# EAGLE design G4_TechWatch-BASIC (EAGLE 9.6.2)
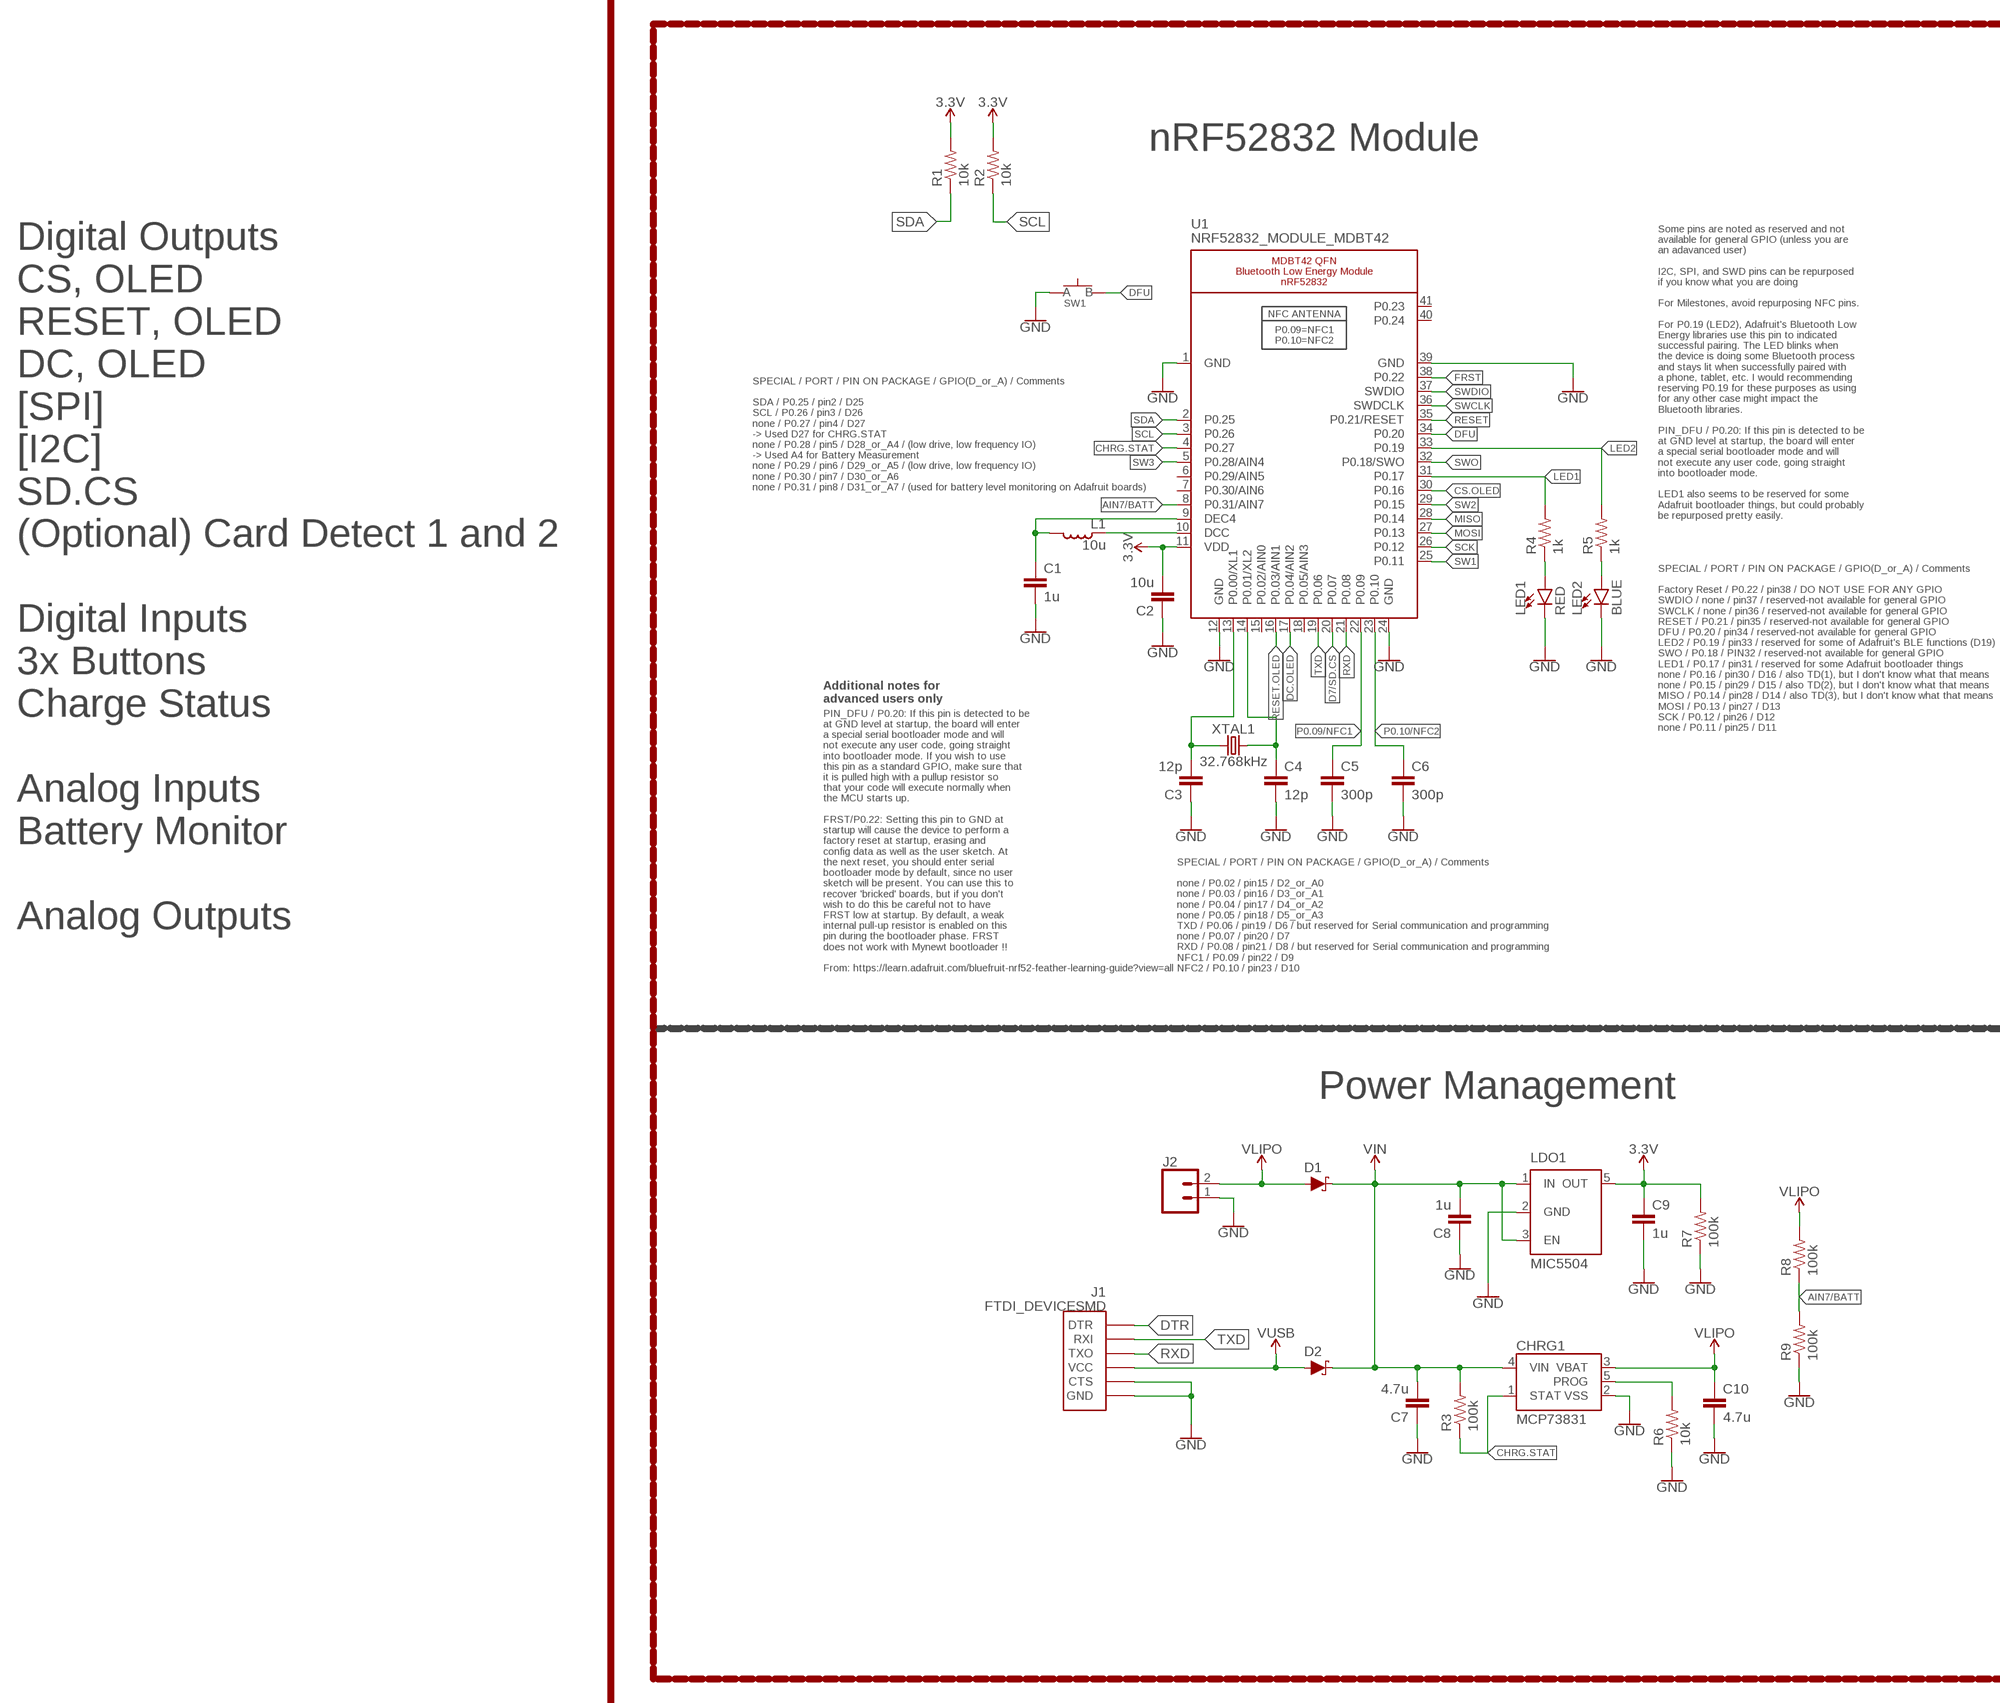
[diagram p0: schematic, sheet 1, part 1 of 2]
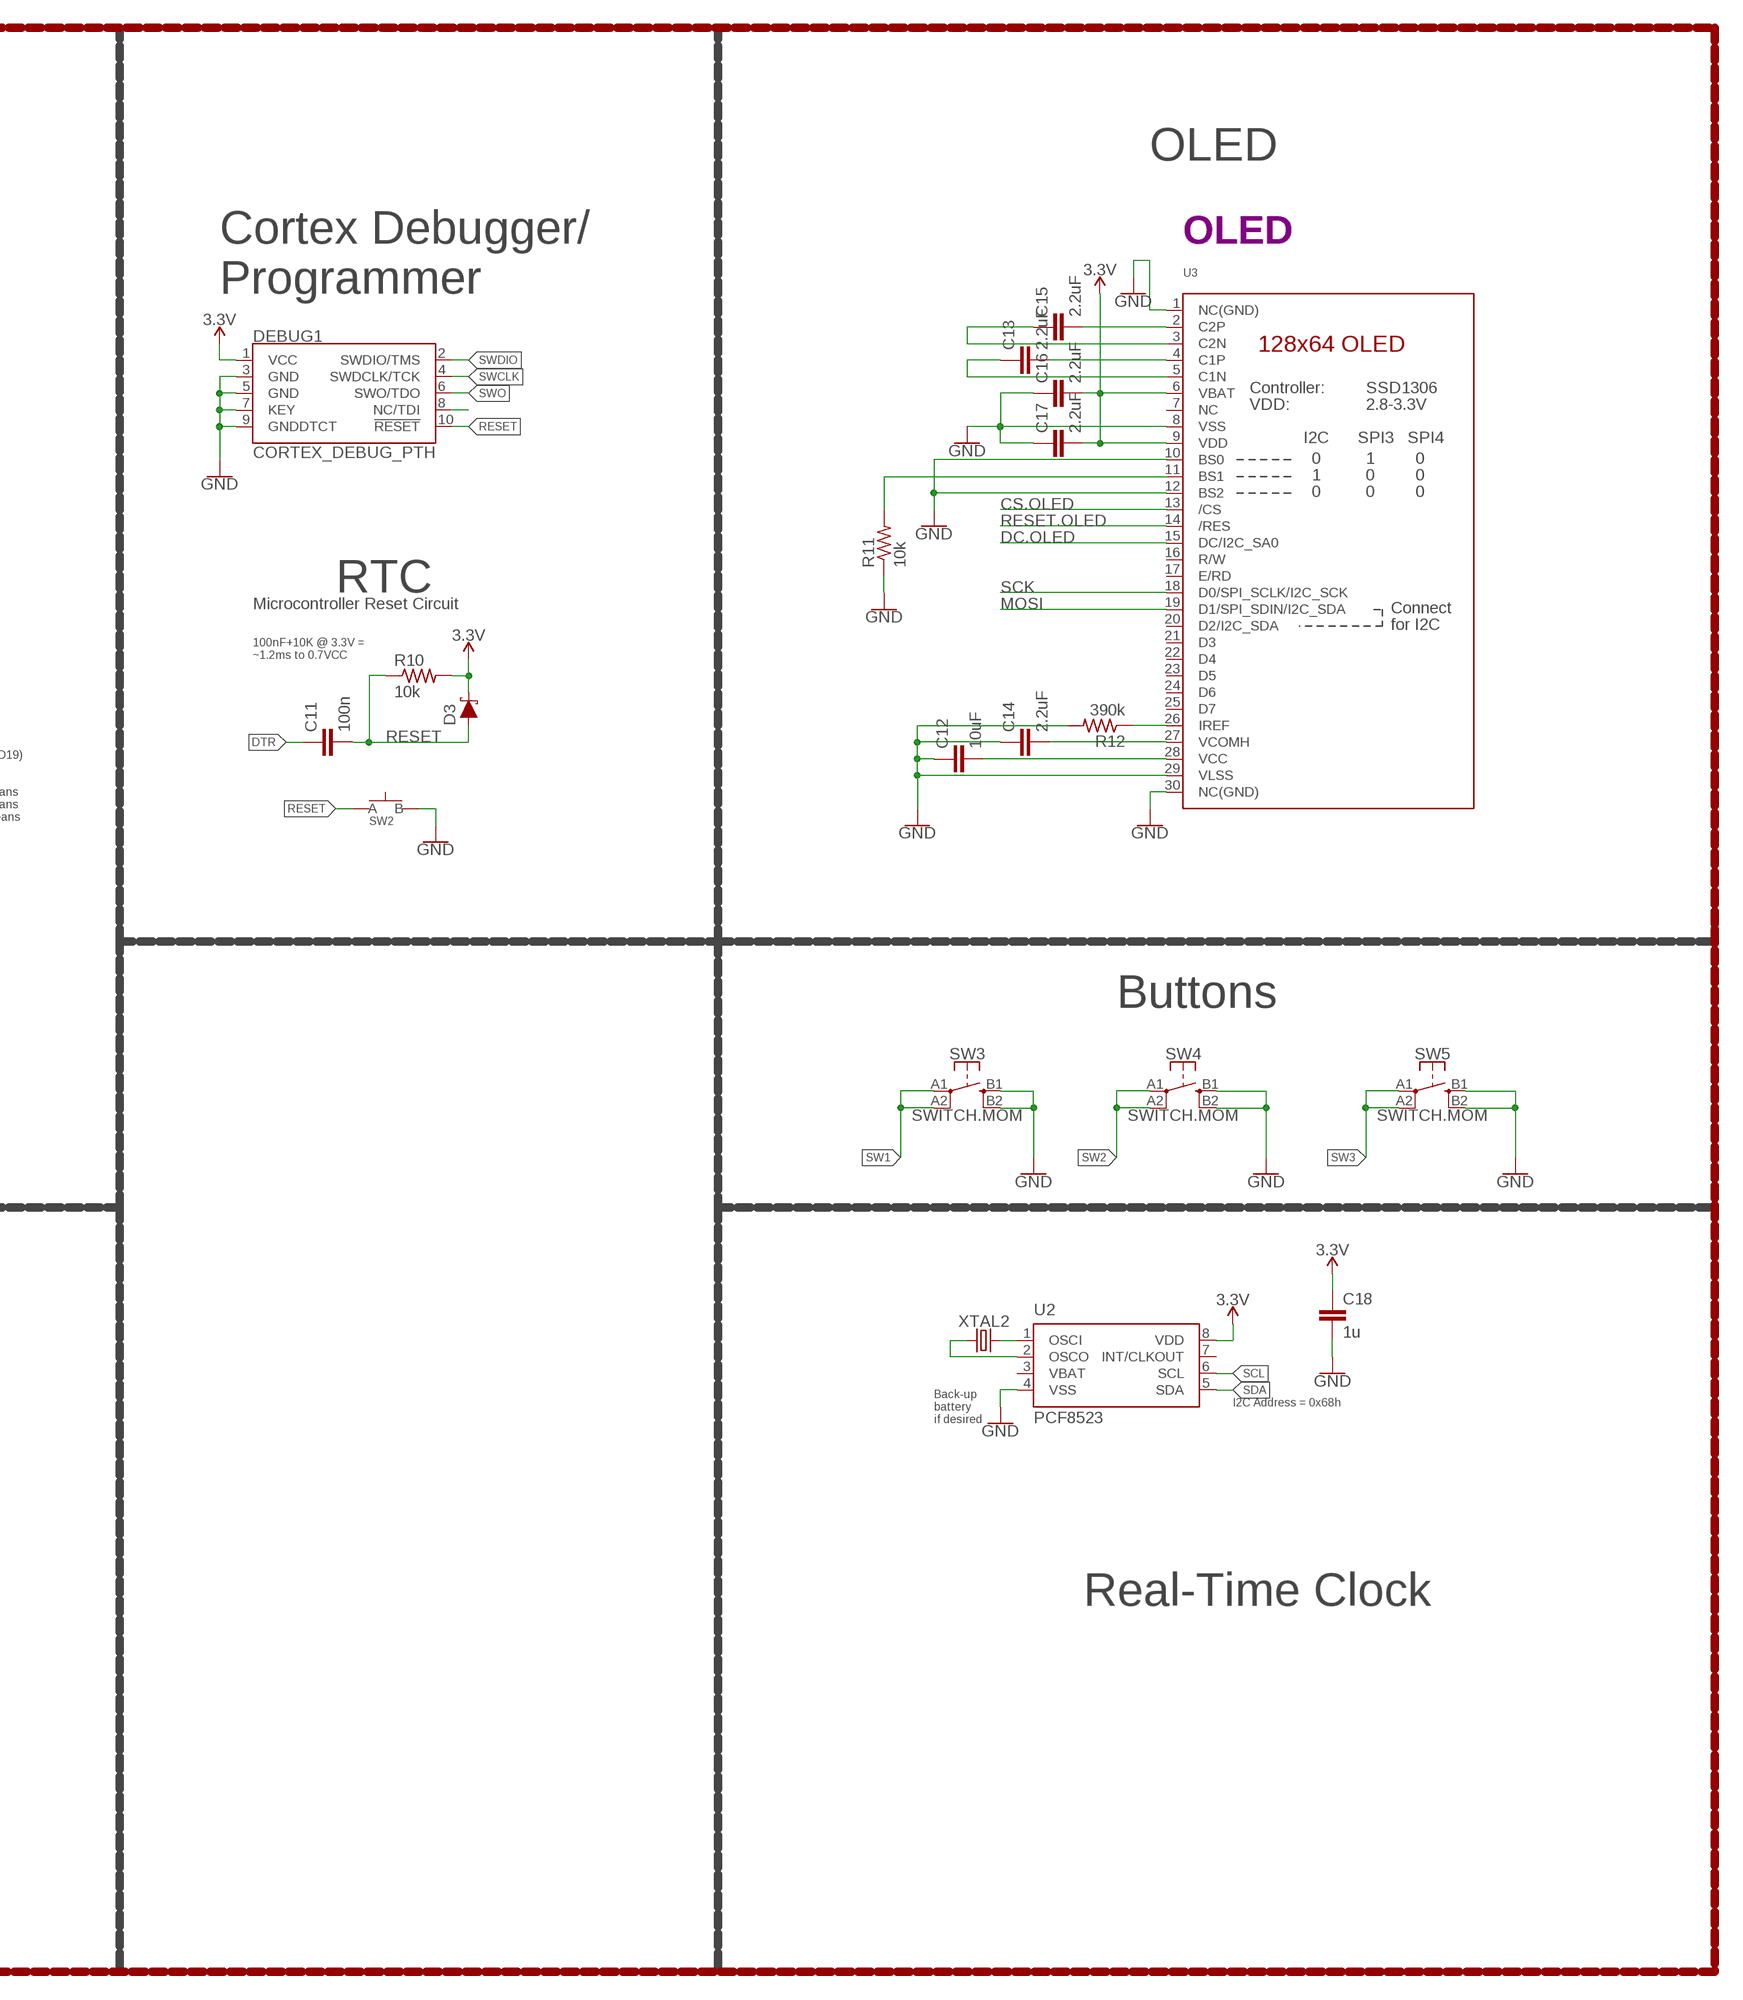
[diagram p1: schematic, sheet 1, part 2 of 2]

## Parts
C1  1u  CAPACITOR0603  [C0603]
C2  10u  CAPACITOR0805  [C0805]
C3  12p  CAPACITOR0603  [C0603]
C4  12p  CAPACITOR0603  [C0603]
C5  300p  CAPACITOR0603  [C0603]
C6  300p  CAPACITOR0603  [C0603]
C7  4.7u  CAPACITOR0603  [C0603]
C8  1u  CAPACITOR0603  [C0603]
C9  1u  CAPACITOR0603  [C0603]
C10  4.7u  CAPACITOR0603  [C0603]
C11  100n  CAPACITOR0603  [C0603]
C12  10uF  CAPACITOR0603  [C0603]
C13  2.2uF  CAPACITOR0402  [C0402]
C14  2.2uF  CAPACITOR0402  [C0402]
C15  2.2uF  CAPACITOR0402  [C0402]
C16  2.2uF  CAPACITOR0402  [C0402]
C17  2.2uF  CAPACITOR0402  [C0402]
C18  1u  CAPACITOR0603  [C0603]
CHRG1  MCP73831  [SOT23-5]
D1  SCHOTTKY-USC  [USC]
D2  SCHOTTKY-USC  [USC]
D3  SCHOTTKY-USC  [USC]
DEBUG1  CORTEX_DEBUG_PTH  [2X5-PTH-1.27MM]
J1  FTDI_DEVICESMD  [FTDI-SMD]
J2  CONN_02  [1X02]
L1  10u  INDUCTOR0603  [L0603]
LDO1  MIC5504  [SOT23-5]
LED1  RED  LED0603  [LED-0603]
LED2  BLUE  LED0603  [LED-0603]
R1  10k  RESISTOR0603  [R0603]
R2  10k  RESISTOR0603  [R0603]
R3  100k  RESISTOR0603  [R0603]
R4  1k  RESISTOR0603  [R0603]
R5  1k  RESISTOR0603  [R0603]
R6  10k  RESISTOR0603  [R0603]
R7  100k  RESISTOR0603  [R0603]
R8  100k  RESISTOR0603  [R0603]
R9  100k  RESISTOR0603  [R0603]
R10  10k  RESISTOR0603  [R0603]
R11  10k  RESISTOR0603  [R0603]
R12  390k  RESISTOR0603  [R0603]
SW1  SPST-PTS830GG140-COPY.1-3  [BUTTON-GULLWING]
SW2  SPST-PTS830GG140-COPY.1-3  [BUTTON-GULLWING]
SW3  SWITCH.MOM  [TACTILE_SWITCH_SMD_6.2MM_TALL]
SW4  SWITCH.MOM  [TACTILE_SWITCH_SMD_6.2MM_TALL]
SW5  SWITCH.MOM  [TACTILE_SWITCH_SMD_6.2MM_TALL]
U1  NRF52832_MODULE_MDBT42  [BLE_MODULE_RAYTAC_MDBT42]
U2  PCF8523  [SO8]
U3  DISP_OLED_UG-2864HSWEG01-NO-WRAPAROUND  [UG-2864HSWEG01_0.96IN_NO-WRAPAROUND]
XTAL1  32.768kHz  CRYSTALECS-.327-12.5-12-C-TR  [2-SMD.NOLEAD.2.0MMTO1.2MM]
XTAL2  32.7680kHz  CRYSTALECS-.327-12.5-12-C-TR  [2-SMD.NOLEAD.2.0MMTO1.2MM]

## Nets
3.3V: C2.2 C9.1 C16.2 C17.2 C18.1 D3.-(C) DEBUG1.1(VCC) LDO1.5(OUT) R1.2 R2.2 R7.2 R10.2 U1.11(VDD) U2.8(VDD) U3.6(VBAT) U3.9(VDD)
AIN7/BATT: R8.1 R9.2 U1.8(P0.31/AIN7)
CHRG.STAT: CHRG1.1(STAT) R3.1 U1.4(P0.27)
CS.OLED: U1.30(P0.16) U3.13(/CS)
D7/SD.CS: U1.20(P0.07)
DC.OLED: U1.17(P0.04/AIN2) U3.15(DC/I2C_SA0)
DFU: SW1.3(B) U1.34(P0.20)
DTR: C11.1 J1.DTR
FRST: U1.38(P0.22)
GND: C1.2 C2.1 C3.1 C4.2 C5.2 C6.2 C7.1 C8.1 C9.2 C10.2 C12.1 C14.1 C16.1 C17.1 C18.2 CHRG1.2(VSS) DEBUG1.3(GND) DEBUG1.5(GND) DEBUG1.7(KEY) DEBUG1.9(GNDDTCT) J1.CTS J1.GND J2.1 LDO1.2(GND) LED1.C LED2.C R6.1 R7.1 R9.1 R11.1 R12.2 SW1.1(A) SW2.3(B) SW3.B1 SW3.B2 SW4.B1 SW4.B2 SW5.B1 SW5.B2 U1.1(GND) U1.12(GND) U1.24(GND) U1.39(GND) U2.4(VSS) U3.1(NC(GND)) U3.8(VSS) U3.10(BS0) U3.12(BS2) U3.29(VLSS) U3.30(NC(GND))
LED1: R4.2 U1.31(P0.17)
LED2: R5.2 U1.33(P0.19)
MISO: U1.28(P0.14)
MOSI: U1.27(P0.13) U3.19(D1/SPI_SDIN/I2C_SDA)
N$1: R11.2 U3.11(BS1)
N$2: R12.1 U3.26(IREF)
N$3: C15.2 U3.2(C2P)
N$4: C3.2 U1.13(P0.00/XL1) XTAL1.P$1
N$5: C15.1 U3.3(C2N)
N$6: C4.1 U1.14(P0.01/XL2) XTAL1.P$2
N$7: C13.2 U3.4(C1P)
N$8: C13.1 U3.5(C1N)
N$9: LED1.A R4.1
N$10: LED2.A R5.1
N$11: L1.1 U1.10(DCC)
N$12: C1.1 L1.2 U1.9(DEC4)
N$13: C12.2 U3.28(VCC)
N$14: DEBUG1.8(NC/TDI)
N$15: C14.2 U3.27(VCOMH)
N$17: CHRG1.5(PROG) R6.2
N$19: U2.2(OSCO) XTAL2.P$1
N$20: U2.1(OSCI) XTAL2.P$2
P0.09/NFC1: C5.1 U1.22(P0.09)
P0.10/NFC2: C6.1 U1.23(P0.10)
RESET: C11.2 D3.+(A) DEBUG1.10(!RESET) R10.1 SW2.1(A) U1.35(P0.21/RESET)
RESET.OLED: U1.16(P0.03/AIN1) U3.14(/RES)
RXD: J1.TXO U1.21(P0.08)
SCK: U1.26(P0.12) U3.18(D0/SPI_SCLK/I2C_SCK)
SCL: R2.1 U1.3(P0.26) U2.6(SCL)
SDA: R1.1 U1.2(P0.25) U2.5(SDA)
SW1: SW3.A1 SW3.A2 U1.25(P0.11)
SW2: SW4.A1 SW4.A2 U1.29(P0.15)
SW3: SW5.A1 SW5.A2 U1.5(P0.28/AIN4)
SWCLK: DEBUG1.4(SWDCLK/TCK) U1.36(SWDCLK)
SWDIO: DEBUG1.2(SWDIO/TMS) U1.37(SWDIO)
SWO: DEBUG1.6(SWO/TDO) U1.32(P0.18/SWO)
TXD: J1.RXI U1.19(P0.06)
V_USB: D2.+(A) J1.VCC ; supply symbol labelled VUSB
VIN: C7.2 C8.2 CHRG1.4(VIN) D1.-(C) D2.-(C) LDO1.1(IN) LDO1.3(EN) R3.2
VLIPO: C10.1 CHRG1.3(VBAT) D1.+(A) J2.2 R8.2
Unconnected: U1.6(P0.29/AIN5) U1.7(P0.30/AIN6) U1.15(P0.02/AIN0) U1.18(P0.05/AIN3) U1.40(P0.24) U1.41(P0.23) U2.7(INT/CLKOUT) U3.7(NC) U3.16(R/W) U3.17(E/RD) U3.20(D2/I2C_SDA) U3.21(D3) U3.22(D4) U3.23(D5) U3.24(D6) U3.25(D7)

## Notes on the sheet
- OLED
- nRF52832 Module
- OLED
- Cortex Debugger/
  Programmer
- SPECIAL / PORT / PIN ON PACKAGE / GPIO(D_or_A) / Comments
  
  SDA / P0.25 / pin2 / D25
  SCL / P0.26 / pin3 / D26
  none / P0.27 / pin4 / D27 
  -> Used D27 for CHRG.STAT
  none / P0.28 / pin5 / D28_or_A4 / (low drive, low frequency IO) 
  -> Used A4 for Battery Measurement
  none / P0.29 / pin6 / D29_or_A5 / (low drive, low frequency IO)
  none / P0.30 / pin7 / D30_or_A6
  none / P0.31 / pin8 / D31_or_A7 / (used for battery level monitoring on Adafruit boards)
- RTC
- Some pins are noted as reserved and not
  available for general GPIO (unless you are
  an adavanced user)
  
  I2C, SPI, and SWD pins can be repurposed
  if you know what you are doing
  
  For Milestones, avoid repurposing NFC pins.
  
  For P0.19 (LED2), Adafruit's Bluetooth Low
  Energy libraries use this pin to indicated
  successful pairing. The LED blinks when
  the device is doing some Bluetooth process
  and stays lit when successfully paired with
  a phone, tablet, etc. I would recommending
  reserving P0.19 for these purposes as using
  for any other case might impact the
  Bluetooth libraries.
  
  PIN_DFU / P0.20: If this pin is detected to be
  at GND level at startup, the board will enter
  a special serial bootloader mode and will
  not execute any user code, going straight
  into bootloader mode.
  
  LED1 also seems to be reserved for some
  Adafruit bootloader things, but could probably
  be repurposed pretty easily.
- Microcontroller Reset Circuit
- 100nF+10K @ 3.3V =
  ~1.2ms to 0.7VCC
- Additional notes for
  advanced users only
- SPECIAL / PORT / PIN ON PACKAGE / GPIO(D_or_A) / Comments
  
  Factory Reset / P0.22 / pin38 / DO NOT USE FOR ANY GPIO
  SWDIO / none / pin37 / reserved-not available for general GPIO
  SWCLK / none / pin36 / reserved-not available for general GPIO
  RESET / P0.21 / pin35 / reserved-not available for general GPIO
  DFU / P0.20 / pin34 / reserved-not available for general GPIO
  LED2 / P0.19 / pin33 / reserved for some of Adafruit's BLE functions (D19)
  SWO / P0.18 / PIN32 / reserved-not available for general GPIO
  LED1 / P0.17 / pin31 / reserved for some Adafruit bootloader things
  none / P0.16 / pin30 / D16 / also TD(1), but I don't know what that means
  none / P0.15 / pin29 / D15 / also TD(2), but I don't know what that means
  MISO / P0.14 / pin28 / D14 / also TD(3), but I don't know what that means
  MOSI / P0.13 / pin27 / D13
  SCK / P0.12 / pin26 / D12
  none / P0.11 / pin25 / D11
- Buttons
- Digital Outputs
  CS, OLED
  RESET, OLED
  DC, OLED
  [SPI]
  [I2C]
  SD.CS
  (Optional) Card Detect 1 and 2
  
  Digital Inputs
  3x Buttons
  Charge Status
  
  Analog Inputs
  Battery Monitor
  
  Analog Outputs
- PIN_DFU / P0.20: If this pin is detected to be
  at GND level at startup, the board will enter
  a special serial bootloader mode and will
  not execute any user code, going straight
  into bootloader mode. If you wish to use
  this pin as a standard GPIO, make sure that
  it is pulled high with a pullup resistor so
  that your code will execute normally when
  the MCU starts up.
  
  FRST/P0.22: Setting this pin to GND at
  startup will cause the device to perform a
  factory reset at startup, erasing and
  config data as well as the user sketch. At
  the next reset, you should enter serial
  bootloader mode by default, since no user
  sketch will be present. You can use this to
  recover 'bricked' boards, but if you don't
  wish to do this be careful not to have
  FRST low at startup. By default, a weak
  internal pull-up resistor is enabled on this
  pin during the bootloader phase. FRST
  does not work with Mynewt bootloader !!
  
  From: https://learn.adafruit.com/bluefruit-nrf52-feather-learning-guide?view=all
- SPECIAL / PORT / PIN ON PACKAGE / GPIO(D_or_A) / Comments
  
  none / P0.02 / pin15 / D2_or_A0
  none / P0.03 / pin16 / D3_or_A1
  none / P0.04 / pin17 / D4_or_A2
  none / P0.05 / pin18 / D5_or_A3
  TXD / P0.06 / pin19 / D6 / but reserved for Serial communication and programming
  none / P0.07 / pin20 / D7
  RXD / P0.08 / pin21 / D8 / but reserved for Serial communication and programming
  NFC1 / P0.09 / pin22 / D9
  NFC2 / P0.10 / pin23 / D10
- Power Management
- I2C Address = 0x68h
- Back-up
  battery
  if desired
- Real-Time Clock

## Power pins joined to a net without a drawn wire
VBAT: U2.3(VBAT)

## Library data of the parts
C1-C18 = LinnesLab-Passives:CAPACITOR
CHRG1 = LinnesLab-Power:MCP73831: MCP73831T Li-Ion, Li-Pol Controller Miniature single cell, fully integrated Li-Ion, Li-polymer charge management controller Datasheet <http://ww1.microchip.com/downloads/en/DeviceDoc/20001984g.pdf> SparkFun Products: SparkFun ESP32 Thing <https://www.sparkfun.com/products/13907> SparkFun 9DoF Razor IMU M0 <https://www.sparkfun.com/products/14001>; PROD_ID: IC-09995
D1-D3 = LinnesLab-DiscreteSemi:SCHOTTKY: Schottky diode A Schottky diode is a semiconductor diode which has a low forward voltage drop and a very fast switching action. Example: Digi-Key Part Number: RB161MM-20CT-ND
DEBUG1 = LinnesLab-Connectors:CORTEX_DEBUG: Cortex Debug Connector - 10 pin Supports JTAG debug, Serial Wire debug, and Serial Wire Viewer. PTH and SMD connector options available. General Connector Information <http://infocenter.arm.com/help/topic/com.arm.doc.faqs/attached/13634/cortex_debug_connectors.pdf> Products: PTH Connector <http://www.digikey.com/product-detail/en/cnc-tech/3220-10-0100-00/1175-1627-ND/3883661> -via Digi-Key SparkFun PSoc <https://www.sparkfun.com/products/13229> SparkFun T <https://www.sparkfun.com/products/13810>
J1 = LinnesLab-Connectors:FTDI_DEVICE
J2 = LinnesLab-Connectors:CONN_02: Multi connection point. Often used as Generic Header-pin footprint for 0.1 inch spaced/style header connections On any of the 0.1 inch spaced packages, you can populate with these: Break Away Headers - Straight <https://www.sparkfun.com/products/116> (PRT-00116) Break Away Male Headers - Right Angle <https://www.sparkfun.com/products/553> (PRT-00553) Female Headers <https://www.sparkfun.com/products/115> (PRT-00115) Break Away Headers - Machine Pin <https://www.sparkfun.com/products/117> (PRT-00117) Break Away Female Headers - Swiss Machine Pin <https://www.sparkfun.com/products/743> (PRT-00743) For SCREWTERMINALS and SPRING TERMINALS visit here: Screw Terimnals on SparkFun.com <https://www.sparkfun.com/search/results?term=Screw+Terminals> (5mm/3.5mm/2.54mm spacing) This device is also useful as a general connection point to wire up your design to another part of your project. Our various solder wires solder well into these plated through hole pads. Hook-Up Wire - Assortment (Stranded, 22 AWG) <https://www.sparkfun.com/products/11375> (PRT-11375) Hook-Up Wire - Assortment (Solid Core, 22 AWG) <https://www.sparkfun.com/products/11367> (PRT-11367) View the entire wire category on our website here <https://www.sparkfun.com/categories/141> Special notes: Molex polarized connector foot print use with: PRT-08233 with associated crimp pins and housings. 2.54_SCREWTERM for use with PRT-10571. 3.5mm Screw Terminal footprints for PRT-08084 5mm Screw Terminal footprints for use with PRT-08432
L1 = LinnesLab-Passives:INDUCTOR
LDO1 = LinnesLab-Power:MIC5504: MIC5504 Voltage Regulator Output Voltages: 1.0V to 3.3V Input Voltages: 2.5V to 5.5V Link to Datasheet http://ww1.microchip.com/downloads/en/DeviceDoc/MIC550X.pdf
LED1 LED2 = LinnesLab-LED:LED: LED (Generic) Standard schematic elements and footprints for 5mm, 3mm, 1206, and 0603 sized LEDs. Generic LEDs with no color specified. LTST-C190KGKT: arrow indicates cathode
R1-R12 = LinnesLab-Passives:RESISTOR
SW1 SW2 = LinnesLab-Switches:SPST-PTS830GG140-COPY
SW3-SW5 = LinnesLab-Switches:SWITCH.MOM: PTS645SM43SMTR92 LFS
U1 = LinnesLab-Microcontrollers:NRF52832_MODULE_MDBT42: MDBT42 - BLE Module (nRF52832 QFN) VDD: 1.7-3.6V
U2 = LinnesLab-Clocks:PCF8523; DIGIKEY: 568-5306-1-ND; I2C_ADDRESS: 0x68h; MFN: PCF8523T/1,118; MFN_MANUFACTURER: NXP USA Inc.
U3 = LinnesLab-Displays:DISP_OLED_UG-2864HSWEG01: UG-2864HSWEG01 OLED display Both 1.3" and 0.96" models share the same FPC tab footprint, only the screen dimensions vary.
XTAL1 XTAL2 = LinnesLab-Clocks:CRYSTAL; DIGIKEY: XC2288CT-ND; FREQ: 32.7680KHZ; LOAD_CAP: 12.5pF

## Board
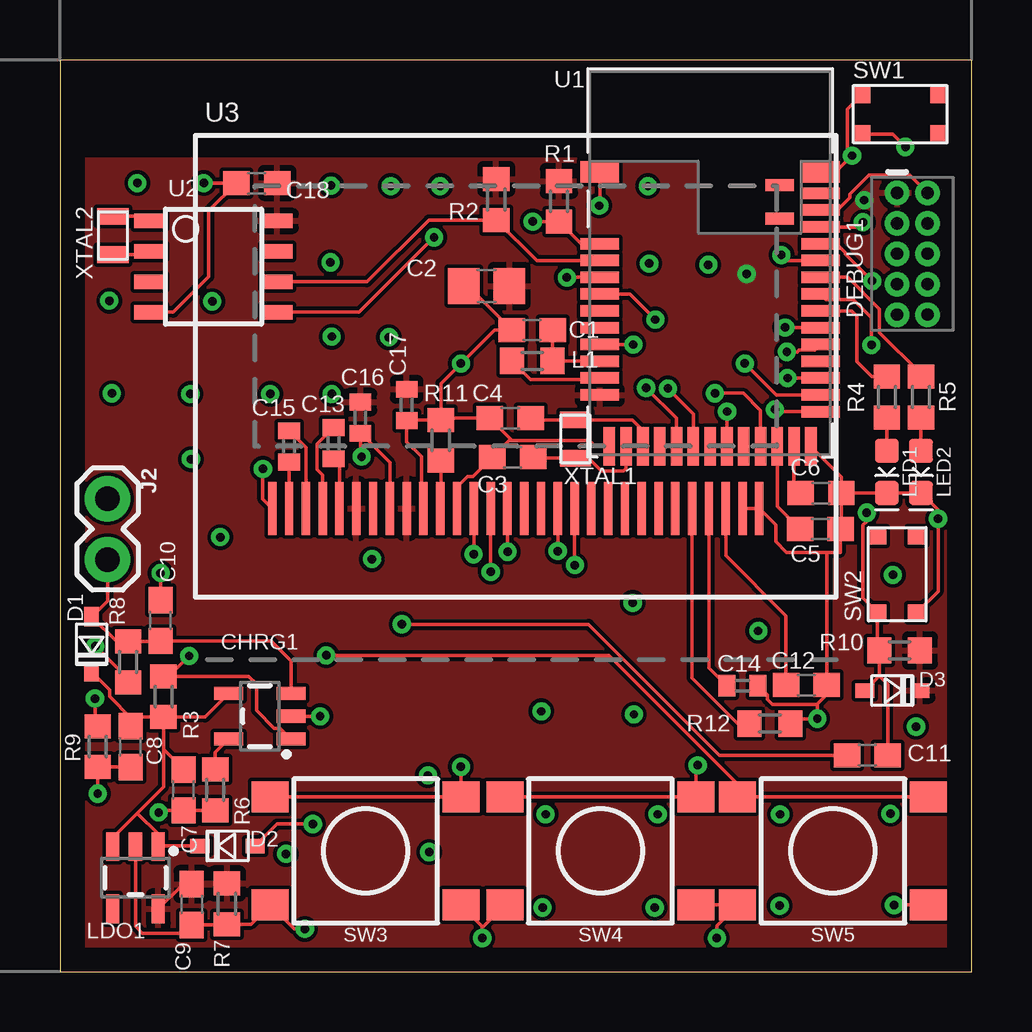
[diagram p2: board, top side]
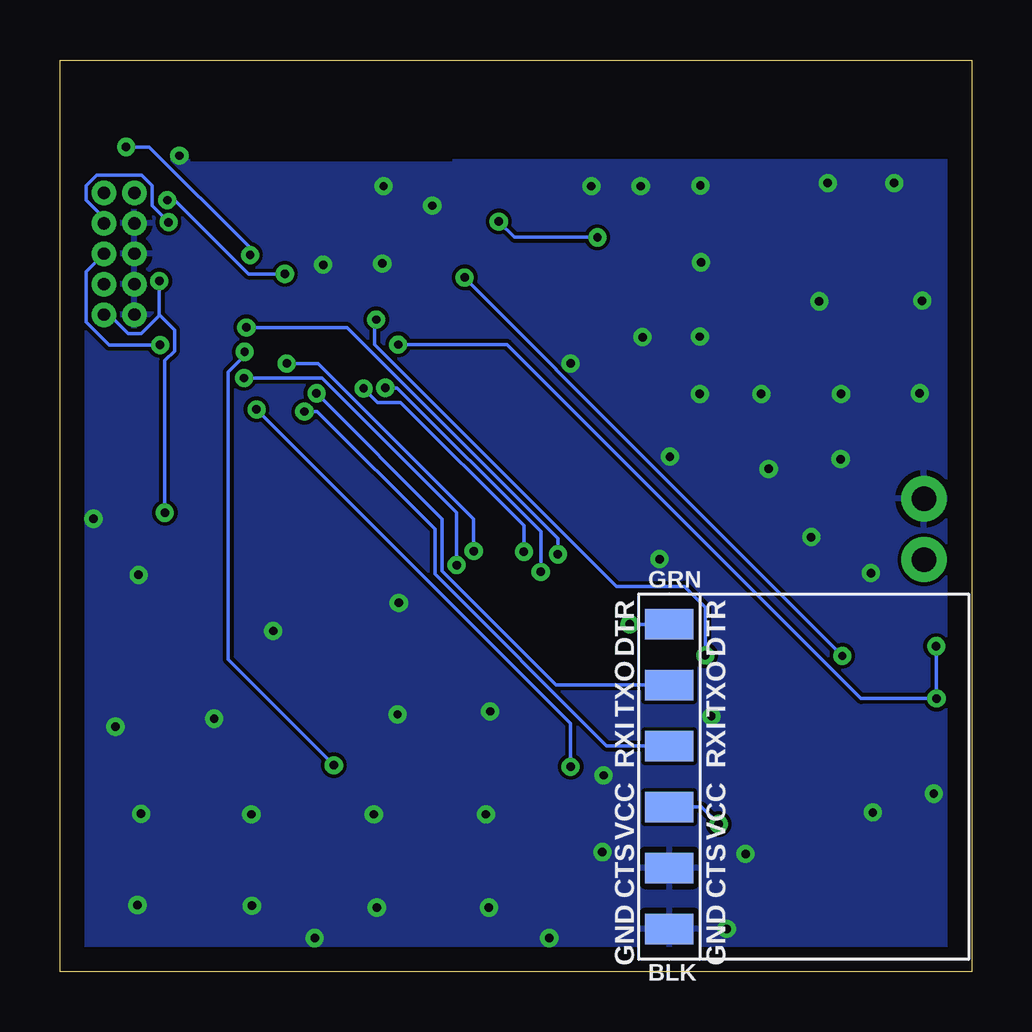
[diagram p3: board, bottom side, seen from below]

Size 38 x 38 mm. Coordinates in mm from the lower left corner, seen from the top.
Outline: 0,0 38,0 38,38 0,38 0,0
Copper layers (1*16): Top 0.035mm / dielectric 1.5mm / Bottom 0.035mm
Design rules "default": minimum track width 6mil, minimum drill 0.35mm, track to track 6mil, track to pad 6mil, pad to pad 6mil, via to via 6mil, smd to smd 6mil, copper to edge 40mil, drill to drill 6mil, minimum pad ring 10mil, minimum via ring 8mil, stop-mask expansion 4mil, vias tented up to drill 0mil, thermal gap 10mil

### Footprints (pad centres in the part's own frame; a part is rotated, then mirrored left to right if it is on the bottom)
C0603 = smd 1.1 x 1: 1 -0.85,0; 2 0.85,0
C0805 = smd 1.3 x 1.5: 1 -0.95,0; 2 0.95,0
C0402 = smd 0.7 x 0.9: 1 -0.65,0; 2 0.65,0
SOT23-5 = smd 0.55 x 1.2: 1 -0.95,-1.3; 2 0,-1.3; 3 0.95,-1.3; 4 0.95,1.3; 5 -0.95,1.3
USC = smd 0.8 x 0.6: + -1.15,0; - 1.15,0
2X5-PTH-1.27MM = drill 0.508 pad 1: 1 -2.54,-0.635; 2 -2.54,0.635; 3 -1.27,-0.635; 4 -1.27,0.635; 5 0,-0.635; 6 0,0.635; 7 1.27,-0.635; 8 1.27,0.635; 9 2.54,-0.635; 10 2.54,0.635
FTDI-SMD = smd 1.27 x 2.03: CTS 3.81,0; DTR -6.35,0; GND 6.35,0; RXI -1.27,0; TXO -3.81,0; VCC 1.27,0
1X02 = drill 1.016 pad 1.88: 1 0,0; 2 2.54,0
L0603 = smd 1 x 1.1: 1 -0.85,0; 2 0.85,0
LED-0603 = smd 1 x 1: A -0.877,0; C 0.877,0
R0603 = smd 1 x 1.1: 1 -0.85,0; 2 0.85,0
BUTTON-GULLWING = smd 0.7 x 0.75: 1 -1.6,0.825; 2 1.6,0.825; 3 -1.6,-0.825; 4 1.6,-0.825
TACTILE_SWITCH_SMD_6.2MM_TALL = smd 1.55 x 1.3: A1 -3.975,-2.25; A2 3.975,-2.25; B1 -3.975,2.25; B2 3.975,2.25
BLE_MODULE_RAYTAC_MDBT42 = smd 1.6 x 0.9: 1 -4.6,3.8; 39 4.6,3.8 | smd 1.6 x 0.48: 2 -4.6,0.8; 3 -4.6,0.1; 4 -4.6,-0.6; 5 -4.6,-1.3; 6 -4.6,-2; 7 -4.6,-2.7; 8 -4.6,-3.4; 9 -4.6,-4.1; 10 -4.6,-4.8; 11 -4.6,-5.5; 25 4.6,-6.2; 26 4.6,-5.5; 27 4.6,-4.8; 28 4.6,-4.1; 29 4.6,-3.4; 30 4.6,-2.7; 31 4.6,-2; 32 4.6,-1.3; 33 4.6,-0.6; 34 4.6,0.1; 35 4.6,0.8; 36 4.6,1.5; 37 4.6,2.2; 38 4.6,2.9 | smd 0.48 x 1.6: 12 -4.2,-7.65; 13 -3.5,-7.65; 14 -2.8,-7.65; 15 -2.1,-7.65; 16 -1.4,-7.65; 17 -0.7,-7.65; 18 0,-7.65; 19 0.7,-7.65; 20 1.4,-7.65; 21 2.1,-7.65; 22 2.8,-7.65; 23 3.5,-7.65; 24 4.2,-7.65 | smd 1.2 x 0.5: 40 2.9,3.25; 41 2.9,1.85
SO8 = smd 1.3 x 0.6: 1 -2.65,1.905; 2 -2.65,0.635; 3 -2.65,-0.635; 4 -2.65,-1.905; 5 2.65,-1.905; 6 2.65,-0.635; 7 2.65,0.635; 8 2.65,1.905
UG-2864HSWEG01_0.96IN_NO-WRAPAROUND = smd 0.35 x 2.2: 1 -10.15,-1.2; 2 -9.45,-1.2; 3 -8.75,-1.2; 4 -8.05,-1.2; 5 -7.35,-1.2; 6 -6.65,-1.2; 7 -5.95,-1.2; 8 -5.25,-1.2; 9 -4.55,-1.2; 10 -3.85,-1.2; 11 -3.15,-1.2; 12 -2.45,-1.2; 13 -1.75,-1.2; 14 -1.05,-1.2; 15 -0.35,-1.2; 16 0.35,-1.2; 17 1.05,-1.2; 18 1.75,-1.2; 19 2.45,-1.2; 20 3.15,-1.2; 21 3.85,-1.2; 22 4.55,-1.2; 23 5.25,-1.2; 24 5.95,-1.2; 25 6.65,-1.2; 26 7.35,-1.2; 27 8.05,-1.2; 28 8.75,-1.2; 29 9.45,-1.2; 30 10.15,-1.2
2-SMD.NOLEAD.2.0MMTO1.2MM = smd 0.7 x 1.3: P$1 -0.8,0; P$2 0.8,0

### Placement (x,y rotation side)
C1  19.68,26.75 180 top
C2  17.78,28.57 0 top
C3  18.87,21.44 0 top
C4  18.77,23.06 180 top
C5  31.7,18.44 0 top
C6  31.72,19.94 0 top
C7  5.16,7.57 90 top
C8  2.95,9.37 90 top
C9  5.49,2.79 270 top
C10  4.19,14.63 90 top
C11  33.66,9.02 0 top
C12  31.11,11.94 180 top
C13  11.4,22.02 90 top
C14  28.45,11.91 180 top
C15  9.55,21.89 270 top
C16  12.52,23.09 90 top
C17  14.45,23.62 90 top
C18  8.2,32.87 180 top
CHRG1  8.33,10.64 90 top
D1  1.32,13.64 270 top
D2  6.99,5.23 180 top
D3  34.7,11.71 0 top
DEBUG1  35.53,29.92 270 top
J1  12.6,8.13 270 bottom
J2  1.98,19.71 270 top
L1  19.68,25.45 0 top
LDO1  3.15,3.91 180 top
LED1  34.47,20.83 270 top
LED2  35.89,20.83 270 top
R1  20.8,32.11 90 top
R2  18.19,32.18 90 top
R3  4.32,11.46 270 top
R4  34.47,23.95 90 top
R5  35.89,23.95 90 top
R6  6.48,7.57 90 top
R7  6.96,2.82 90 top
R8  2.84,12.9 90 top
R9  1.57,9.37 90 top
R10  35,13.39 0 top
R11  15.88,22.15 270 top
R12  29.59,10.34 0 top
SW1  35.03,35.74 0 top
SW2  34.9,16.56 90 top
SW3  12.74,5.03 180 top
SW4  22.53,5.03 180 top
SW5  32.22,5.03 180 top
U1  27.1,29.54 0 top
U2  6.4,29.39 0 top
U3  19,20.5 0 top
XTAL1  21.49,22.2 90 top
XTAL2  2.21,30.68 90 top

### Tracks (layer width: path | path; a pad name or v marks a point on that pad's centre or on a via)
3.3V  (via drill 0.35)
  Top 0.152: C9.1 5.13,3.64 LDO1.5
  Bottom 0.152: v33.53,32.16 33.22,32.16 30.14,29.08 v28.63,29.08
  pour Top: -0.58,33.86 -0.58,-0.74 38.43,-0.74 38.43,33.86
AIN7/BATT  (via drill 0.35)
  Top 0.152: v23.9,26.14 U1.8 | R9.2 1.46,10.34 v1.46,11.38 | v1.47,13.56 2.85,12.19 R8.1
  Bottom 0.152: v23.9,26.14 19.36,26.14 4.61,11.38 v1.46,11.38 1.47,11.39 v1.47,13.56
CHRG.STAT  (via drill 0.35)
  Top 0.152: U1.4 21.14,28.94 v21.13,28.93 | CHRG1.1 9.19,10.14 8.94,10.14 8.19,10.89 8.19,11.99 7.87,12.3 R3.1 4.52,12.3 v5.38,13.16
  Bottom 0.152: v21.13,28.93 17.32,25.12 17.32,25.1 9.05,16.83 v5.38,13.16
CS.OLED  (via drill 0.35)
  Top 0.152: U3.13 v17.25,17.4 | v30.23,26.85 U1.30
  Bottom 0.152: v17.25,17.4 17.25,18.06 26.04,26.85 v30.23,26.85
DC.OLED  (via drill 0.35)
  Top 0.152: U3.15 18.66,19.29 v18.66,17.5 | U1.17 26.4,23.25 v25.34,24.31
  Bottom 0.152: v18.66,17.5 18.66,18.59 23.8,23.73 24.76,23.73 v25.34,24.31
DFU  (via drill 0.35)
  Top 0.152: v35.24,34.37 34.71,34.91 SW1.3 | v30.07,29.87 30.3,29.64 U1.34
  Bottom 0.152: v35.24,34.37 34.28,34.37 30.07,30.17 v30.07,29.87
DTR  (via drill 0.35)
  Top 0.152: v14.25,14.48 22.04,14.48 27.5,9.02 C11.1
  Bottom 0.152: J1.DTR v14.25,14.48
GND  (via drill 0.35)
  Top 0.152: U1.39 32.35,33.34 v33.02,34.01 32.82,34.21 32.82,35.95 SW1.1 | U2.4 4.72,27.48 6.2,28.97 6.2,31.72 C18.2 v5.99,32.87 | SW2.3 36.61,15.84 v36.61,18.87 36.61,19.23 LED2.C LED1.C 34.46,19.94 C6.2 | C6.2 32.58,18.47 C5.2 32.52,18.41 32.52,17.48 31.96,17.48 | U1.24 32.58,20.62 C6.2 | 31.96,17.48 C12.1 | U3.29 U3.30 29.84,18.61 29.84,17.92 30.29,17.48 31.96,17.48 | C12.1 31.98,11.95 | U1.12 22.32,21.89 22.07,22.14 18.84,22.14 | 18.84,22.14 18.73,22.14 C3.1 17.21,20.63 16.98,20.63 16.55,20.2 U3.12 | 18.84,22.14 C4.2 15.94,23.06 R11.1 | C2.1 17.01,28.57 C1.2 18.11,26.75 v16.71,25.35 15.88,24.51 R11.1 | R11.1 14.48,23 C17.1 14.45,22.08 15.07,21.46 15.07,19.38 U3.10 | U3.8 13.75,21.21 C16.1 12.52,21.46 v12.57,21.46 | U1.1 22.5,31.95 v22.48,31.93 | C8.1 R9.1 v1.57,7.42 | R6.1 C7.1 4.21,6.72 v4.12,6.63 | U3.1 8.46,19.69 v8.46,20.95 | SW3.B1 17.6,1.89 17.6,1.82 | 17.6,1.82 v17.6,1.39 | SW4.B2 17.6,1.82 | SW4.B1 SW5.B2 27.38,1.91 v27.38,1.39 | SW5.B1 v34.78,2.77 v34.77,2.77 | LDO1.2 3.15,1.88 3.43,1.6 5.14,1.6 C9.2 6.93,1.94 R7.1 7.96,1.97 SW3.B2 9.76,1.78 v10.21,1.78 | CHRG1.2 v10.85,10.64 | C10.2 v4.19,16.61 | C14.1 29.49,11.52 29.49,11.34 29.7,11.12 31.55,11.12 | 31.55,11.12 31.57,11.1 v31.57,10.54 30.64,10.54 R12.2 | C12.1 31.96,11.54 31.55,11.12
  other vias: 11.3,32.77 13.79,32.74 15.85,32.74 11.28,29.57 24.56,29.51 27.03,29.46 24.51,32.74 3.23,32.87 2.06,27.97 6.35,27.94 11.33,26.47 13.72,26.44 11.33,24.08 8.76,24.08 5.44,24.08 2.16,24.1 5.46,21.36 6.68,18.11 13,17.2 9.42,4.9 15.39,4.98 15.34,8.18 20.12,2.67 24.79,2.67 24.92,6.55 20.24,6.55 20.07,10.85 23.93,10.72 23.88,15.37 29.11,14.2 35.69,10.21 30,2.74 30.02,6.55 34.62,6.58 34.72,16.54
  pour Bottom: -0.36,33.81 -0.36,-0.51 38.25,-0.51 38.25,33.81
LED1
  Top 0.152: U1.31 33.01,27.54 33.22,27.33 33.22,25.43 33.85,24.8 R4.2
LED2
  Top 0.152: R5.2 35.89,24.92 34.16,26.64 34.16,27.62 32.85,28.94 U1.33
MOSI  (via drill 0.35)
  Top 0.152: U3.19 21.45,16.95 v21.46,16.94 | U1.27 v30.33,24.74 | v30.33,24.74
  Bottom 0.152: v21.46,16.94 21.46,19.13 27.07,24.74 v30.32,24.74 v30.33,24.74
N$1
  Top 0.152: R11.2 15.88,19.32 U3.11
N$2
  Top 0.152: U3.26 26.35,12.23 28.25,10.34 R12.1
N$3
  Top 0.152: U3.2 C15.2
N$4
  Top 0.152: U1.13 23.6,20.97 23.49,20.86 22.57,20.86 22.03,21.4 XTAL1.P$1 19.76,21.4 C3.2
N$5
  Top 0.152: C15.1 10.25,21.84 U3.3
N$6
  Top 0.152: U1.14 24.3,22.56 23.86,23 XTAL1.P$2 19.68,23 C4.1
N$7
  Top 0.152: U3.4 10.95,20.7 10.73,20.93 10.73,21.99 C13.2
N$8
  Top 0.152: C13.1 11.65,21.13 U3.5
N$9
  Top 0.152: R4.1 LED1.A
N$10
  Top 0.152: R5.1 LED2.A
N$11
  Top 0.152: U1.10 22.43,24.67 19.61,24.67 L1.1
N$12
  Top 0.152: C1.1 L1.2 22.49,25.45 U1.9
N$13
  Top 0.152: U3.28 27.75,17.34 30.27,14.83 C12.2
N$15
  Top 0.152: U3.27 27.05,12.66 C14.2
N$17
  Top 0.152: R6.2 6.48,9.14 CHRG1.5
N$19
  Top 0.152: XTAL2.P$1 3.61,29.88 U2.2
N$20
  Top 0.152: XTAL2.P$2 3.56,31.48 U2.1
P0.09/NFC1
  Top 0.152: U1.22 29.9,19.39 C5.1
P0.10/NFC2
  Top 0.152: C6.1 30.59,20.22 U1.23
RESET  (via drill 0.35)
  Top 0.152: 34.15,12.31 R10.1 34.08,13.46 SW2.1 33.47,15.56 33.47,18.61 33.63,18.76 v33.63,19.13 | 34.15,12.31 D3.+ | v33.86,28.79 32.73,29.92 32.73,29.98 32.37,30.34 U1.35 | C11.2 34.51,11.96 34.15,12.31
  Bottom 0.152: DEBUG1.10 35.94,27.38 35.15,26.59 34.62,26.59 33.86,27.35 33.86,27.38 | v33.86,28.79 33.86,27.38 | v33.63,19.13 33.63,25.46 33.22,25.87 33.22,26.74 33.86,27.38
RESET.OLED  (via drill 0.35)
  Top 0.152: U3.14 v17.95,16.67 v17.96,16.66 | v24.43,24.33 25.7,23.07 U1.16
  Bottom 0.152: v17.96,16.66 17.96,18.34 23.95,24.33 v24.43,24.33
RXD  (via drill 0.35)
  Top 0.152: v27.3,24.11 28.49,24.11 29.2,23.39 U1.21
  Bottom 0.152: v27.3,24.11 22.07,18.87 22.07,16.69 17.32,11.94 J1.TXO
SCK  (via drill 0.35)
  Top 0.152: U3.18 v20.75,17.53 | v28.55,25.35 29.86,24.04 U1.26
  Bottom 0.152: v20.75,17.53 20.75,18.86 27.24,25.35 v28.55,25.35
SCL
  Top 0.152: U1.3 19.88,29.64 R2.1 15.38,31.33 12.8,28.75 U2.6
SDA  (via drill 0.35)
  Top 0.152: U1.2 21.72,30.34 R1.1 19.72,31.26 v19.71,31.27 | v15.6,30.61 12.47,27.48 U2.5
  Bottom 0.152: v19.71,31.27 19.05,30.61 v15.6,30.61
SW1  (via drill 0.35)
  Top 0.152: SW3.A2 SW3.A1 v16.71,8.53 | U1.25 29.9,23.34 v29.81,23.43
  Bottom 0.152: v29.81,23.43 16.71,10.34 v16.71,8.53
SW2  (via drill 0.35)
  Top 0.152: SW4.A2 SW4.A1 26.51,8.52 v26.58,8.6 | U1.29 31.47,25.91 30.81,25.91 30.73,25.83 v30.3,25.83
  Bottom 0.152: v30.3,25.83 30.3,25.67 30.98,24.99 30.98,13 v26.58,8.6
SW3  (via drill 0.35)
  Top 0.152: SW5.A1 SW5.A2 28.24,7.82 22.88,13.18 v11.1,13.18 | U1.5 23.75,28.24 v24.82,27.18
  Bottom 0.152: v24.82,27.18 24.89,27.11 24.89,26.14 14.8,16.05 11.97,16.05 11.1,15.18 v11.1,13.18
SWCLK  (via drill 0.35)
  Top 0.152: U1.36 33.27,31.04 v33.47,31.24
  Bottom 0.152: v33.47,31.24 34.16,31.93 34.16,32.77 34.59,33.2 36.48,33.2 36.91,32.77 36.91,32.16 36.17,31.42 DEBUG1.4
SWDIO
  Top 0.152: U1.37 32.4,31.74 32.92,32.26 32.92,32.41 33.71,33.2 35.43,33.2 DEBUG1.2
SWO  (via drill 0.35)
  Top 0.152: U1.32 31.93,28.01 33.08,28.01 33.83,27.26 v33.83,26.12
  Bottom 0.152: DEBUG1.6 36.91,29.18 36.91,27.08 35.94,26.11 v33.84,26.11 v33.83,26.12 | DEBUG1.6
TXD  (via drill 0.35)
  Top 0.152: U1.19 v27.8,23.33 v27.81,23.34
  Bottom 0.152: v27.81,23.34 27.28,23.34 22.38,18.44 22.38,16.56 15.21,9.4 J1.RXI
V_USB  (via drill 0.35)
  Top 0.152: D2.+ 9.05,6.15 v10.54,6.15
  Bottom 0.152: v10.54,6.15 11.25,6.86 J1.VCC
VIN
  Top 0.152: D2.- 4.12,5.23 LDO1.1 4.1,5.73 3.23,6.6 | R3.2 3.33,10.61 C8.2 2.95,10.58 2.07,11.46 2.07,11.74 D1.- | CHRG1.4 6.04,10.61 R3.2 | R3.2 4.32,9.26 | 4.32,9.26 C7.2 | 3.23,6.6 4.32,7.69 4.32,9.26 | 3.23,6.6 2.2,5.57 LDO1.3
VLIPO
  Top 0.152: J2.2 1.98,15.45 D1.+ 2.36,13.75 R8.2 4.16,13.75 C10.1 8.8,13.78 9.63,12.95 CHRG1.3